# Altium schematic sheet PWR_Buck_6V_8A.SchDoc: Sayma RTM
size 420 x 297 mm; $$Internal___BlkDate: 23:43:25_12-13-18; $$Internal_NAME_PLACEHOLDER: a3sheet; $$Internal_Resolution: 00001mm; $$NotCommonProperty_@NAME: PWR_Buck_6V_8A; $$NotCommonProperty_@PRINTORDER: 4; $$NotCommonProperty_@SHEET: 1; $$NotCommonProperty_@SHEETTOTAL: 1; $$NotCommonProperty_FORWARD_PCB: 0; CmpIndex: 6; Drawing Author: G.Kasprowicz; Drawing Number: Sayma RTM; Drawing Project: 8 channel SAWG; Drawing Revision: 2.0; SymIndex: 2227; Author: G.Kasprowicz; CompanyName: WUT ISE; DrawnBy: G.Kasprowicz; Organization: WUT ISE; Address1: PW ISE; Address2: Nowowiejska 15/19 00-665 Warsaw; Address3: gkasprow@gmail.com; DocumentNumber: 13; Revision: 1.0; SheetNumber: 13; SheetTotal: 18; ModifiedBy: -; CheckedDate: -; Title2: +6V buck; DivGrp: WUT ISE; Designer: G.Kasprowicz; ModifiedDate: -; ProjectName: Sensor Box
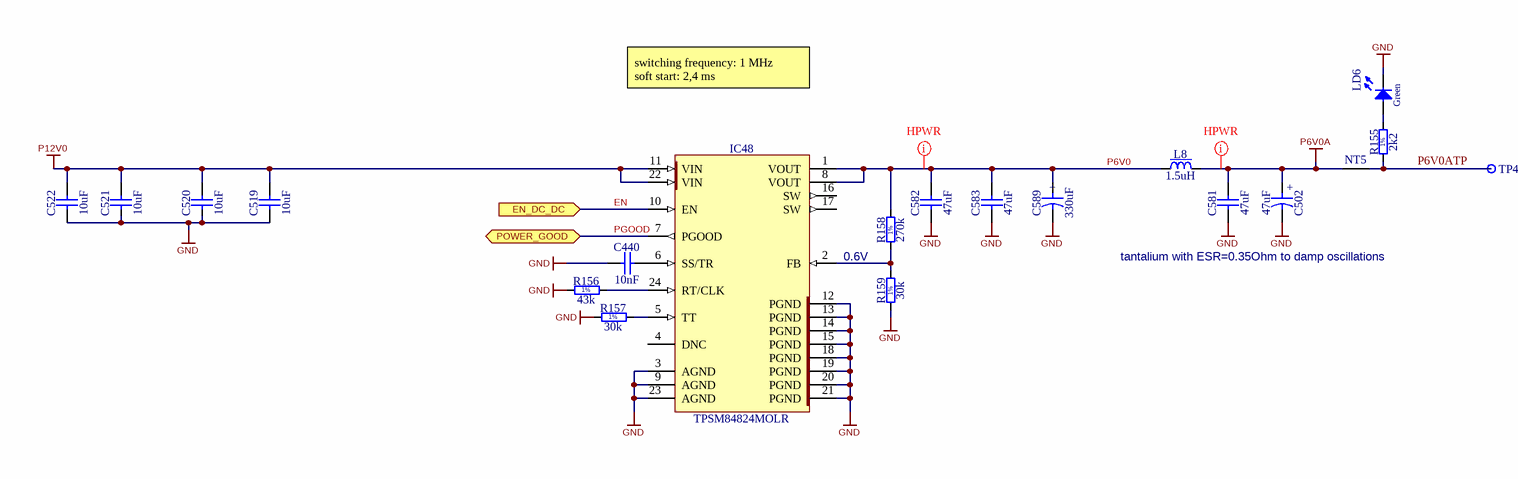
[diagram p0: PWR_Buck_6V_8A.SchDoc]

## Parts
C440  10nF  [CAPC1005X55N]
C502  47uF  [CAPMP6032X280N]
C519  10uF  [CAPC2012X95N]
C520  10uF  [CAPC2012X95N]
C521  10uF  [CAPC2012X95N]
C522  10uF  [CAPC2012X95N]
C581  47uF  [CAPC3225X270N]
C582  47uF  [CAPC3225X270N]
C583  47uF  [CAPC3225X270N]
C589  330uF  [CAPMP7343X310N]
IC48  TPSM84824MOLR  [TEXAS_QFM (MOL)]
L8  1.5uH  [IND_TDK_SPM6530]
LD6  Green  [LED_KINGBRIGHT_KPH-1608CGCK]
NT5  Net Tie  [Net Tie]  (value not drawn)  (net tie, no BOM)
R155  2k2  [RESC1005X40N]
R156  43k  [RESC1005X40N]
R157  30k  [RESC1005X40N]
R158  270k  [RESC1005X40N]
R159  30k  [RESC1005X40N]
TP48  Test Point  [TPS127]  (value not drawn)

## Ports
EN_DC_DC (in), POWER_GOOD (bidir)

## Nets
GND: C440.1 C502.2 C519.1 C520.1 C521.1 C522.1 C581.1 C582.1 C583.1 C589.2 IC48.3(AGND) IC48.9(AGND) IC48.12(PGND) IC48.13(PGND) IC48.14(PGND) IC48.15(PGND) IC48.18(PGND) IC48.19(PGND) IC48.20(PGND) IC48.21(PGND) IC48.23(AGND) LD6.1(C) R156.1 R157.1 R159.1
P6V0A: C502.1 C581.2 L8.2 NT5.1
P12V0: C519.2 C520.2 C521.2 C522.2 IC48.11(VIN) IC48.22(VIN)
EN: IC48.10(EN) ; port EN_DC_DC
P6V0: C582.2 C583.2 C589.1 IC48.1(VOUT) IC48.8(VOUT) L8.1 R158.2
P6V0ATP: NT5.2 R155.1 TP48.1
PGOOD: IC48.7(PGOOD) ; port POWER_GOOD
NetC440_2: C440.2 IC48.6(SS/TR)
NetIC48_2: IC48.2(FB) R158.1 R159.2
NetIC48_5: IC48.5(TT) R157.2
NetIC48_24: IC48.24(RT/CLK) R156.2
NetLD6_2: LD6.2(A) R155.2

Not connected (* = marked no-connect by the designer): IC48 4(DNC) 16(SW) 17(SW)

## Layout directives
net class HPWR: P6V0, P6V0A

## Notes on the sheet
- switching frequency: 1 MHz
  soft start: 2,4 ms
- 0.6V
- tantalium with ESR=0.35Ohm to damp oscillations
- Project/Equipment
- Document
- Designer
- Drawn by
- Check.by
- Copyright WUT ISE 2018.
  This documentation describes Open Hardware and is licensed under the CERN OHL v.1.1. You may redistribute and modify this documentation under the terms of the CERN OHL v.1.1. (http://ohwr.org/CERNOHL). This documentation is distributed WITHOUT ANY EXPRESS OR IMPLIED WARRANTY, INCLUDING OF MERCHANTABILITY, SATISFACTORY QUALITY AND FITNESS FOR A PARTICULAR PURPOSE. Please see the CERN OHL v.1.1 for applicable conditions.
- Contact
- File
- Last Mod.
- Print Date
- Sheet
- Size
- A3
- of
- Rev
- (in symbol CTE6032-28_47UF_16V_10%_LESR0350) +
- (in symbol CTE7343-31_330UF_6.3V_20%_LESR0015_KEMET_T520) +
- (in symbol R0402_2K2_1%_0.0625W_100PPM) 1%
- (in symbol R0402_30K_1%_0.0625W_100PPM) 1%
- (in symbol R0402_30k_1%_0.0625W_100PPM) 1%
- (in symbol R0402_43K_1%_0.0625W_100PPM) 1%
- (in symbol R0402_270K_1%_0.0625W_100PPM) 1%

## Library data of the parts
C440 = CC0402_10NF_16V_10%_X7R: Non-polarised capacitor; Manufacturer: GENERIC; Manufacturer1 Part Number: 223878715636; Part Description: SMD Multilayer Chip Ceramic Capacitor; TC: X7R; Tolerance: ±10%; Voltage: 16V; Case: 0402; Manufacturer Part Number: CC0402_10NF_16V_10%_X7R; Manufacturer1 Example: PHYCOMP; Part Number: CC0402_10NF_16V_10%_X7R; Pin Count: 2; SMD: Yes; Status: Not Recommended; Value: 10nF; Component Kind: Standard; Component Type: Standard; Mounted: Yes; Socket: No; Sense: No; Manufacturer1 ComponentHeight: 0.55mm; HelpURL: \\cern.ch\dfs\Applications\Altium\Datasheets\CC0402_X7R_PHYCOMP.pdf; Author: CERN DEM JLC; CreateDate: 03.12.2007; LatestRevisionDate: 03.12.2007
C502 = CTE6032-28_47UF_16V_10%_LESR0350: Polarised capacitor; Manufacturer: GENERIC; Manufacturer1 Part Number: TPSC476K016R0350; Part Description: Low ESR 0R350 Solid Tantalum Chip Capacitor; Tolerance: ±10%; Voltage: 16V; Case: C; Manufacturer Part Number: CTE6032-28_47UF_16V_10%_LESR0350; Manufacturer1 Example: AVX; Part Number: CTE6032-28_47UF_16V_10%_LESR0350; Pin Count: 2; SMD: Yes; Value: 47uF; Component Kind: Standard; Component Type: Standard; Status: Preferred; Mounted: Yes; Socket: No; Sense: No; Manufacturer1 ComponentHeight: 2.8mm; HelpURL: \\cern.ch\dfs\Applications\Altium\Datasheets\CTE-LESR_AVX_TPS.pdf; Author: CERN DEM JLC; CreateDate: 05.05.2008; LatestRevisionDate: 20.01.2009
C519-C522 = CC0805_10UF_25V_10%_X5R: Non-polarised capacitor; Manufacturer: GENERIC; Manufacturer1 Part Number: GRM219R61E106KA12D; Part Description: SMD Multilayer Chip Ceramic Capacitor; TC: X5R; Tolerance: ±10%; Voltage: 25V; Case: 0805; Manufacturer Part Number: CC0805_10UF_25V_10%_X5R; Manufacturer1 Example: MURATA; Part Number: CC0805_10UF_25V_10%_X5R; Pin Count: 2; SMD: Yes; Status: Preferred; Value: 10uF; Component Kind: Standard; Component Type: Standard; Mounted: Yes; Socket: No; Sense: No; Manufacturer1 ComponentHeight: 0.95mm; HelpURL: \\cern.ch\dfs\Applications\Altium\Datasheets\CC0805_X5R_MURATA_GRM.pdf; Author: CERN DEM JLC; CreateDate: 25.10.2012; LatestRevisionDate: 06.09.2016
C581-C583 = CC1210_47UF_10V_10%_X7R: Non-polarised capacitor; Manufacturer: GENERIC; Manufacturer1 Part Number: GRM32ER71A476KE15; Part Description: SMD Multilayer Chip Ceramic Capacitor; TC: X7R; Tolerance: ±10%; Voltage: 10V; Case: 1210; Manufacturer Part Number: CC1210_47UF_10V_10%_X7R; Manufacturer1 Example: MURATA; Part Number: CC1210_47UF_10V_10%_X7R; Pin Count: 2; SMD: Yes; Status: None; Value: 47uF; Component Kind: Standard; Component Type: Standard; Mounted: Yes; Socket: No; Sense: No; Manufacturer1 ComponentHeight: 2.7mm; HelpURL: \\cern.ch\dfs\Applications\Altium\Datasheets\CC1210_X7R_MURATA.pdf; Author: CERN DEM BC; CreateDate: 18.11.2015; LatestRevisionDate: 18.11.2015
C589 = CTE7343-31_330UF_6.3V_20%_LESR0015_KEMET_T520: Polarised capacitor; Manufacturer Part Number: T520D337M006ATE015; Manufacturer: KEMET; Part Description: Low ESR 0R015 Tantalum Chip Capacitor; Tolerance: ±20%; Voltage: 6.3V; Case: D; ComponentHeight: 3.1mm; Part Number: CTE7343-31_330UF_6.3V_20%_LESR0015_KEMET_T520; Pin Count: 2; SMD: Yes; Status: None; Value: 330uF; Component Kind: Standard; Component Type: Standard; Mounted: Yes; Socket: No; Sense: No; HelpURL: \\cern.ch\dfs\Applications\Altium\Datasheets\CTE-LESR_KEMET_T520.pdf; Author: CERN DEM JLC; CreateDate: 11.01.2012; LatestRevisionDate: 11.01.2012
IC48 = TPSM84824MOLR: 4.5V to 17V Input, 0.6V to 10V Output, 8A Power Module; Manufacturer: TEXAS INSTRUMENTS; Bonding: No; PressFit: No; Status Comment: Solder Paste Deposition Limitation; Author: CERN DEM JLC; Case: QFN; Component Kind: Standard; Component Type: Standard; ComponentHeight: 5.4mm; CreateDate: 27.09.2018; Device: TPSM84824MOLR; HelpURL: \\cern.ch\dfs\Applications\Altium\Datasheets\TPSM84824MOLR.pdf; LatestRevisionDate: 27.09.2018; Manufacturer Part Number: TPSM84824MOLR; Mounted: Yes; PackageDescription: TEXAS QFM (MOL) Case; Part Description: 4.5V to 17V Input, 0.6V to 10V Output, 8A Power Module; Part Number: TPSM84824MOLR; Pin Count: 24; Sense: No; SMD: Yes; Socket: No; Status: Not Recommended
L8 = IND_1.5UH_20%_TDK_SPM6530: Inductor With Core; Manufacturer Part Number: SPM6530T-1R5M100; Manufacturer: TDK; Part Description: SMD Inductor for Power Circuits (Wound Metal), SPM Series; Power: 11A; Resistance: 0.0097R; Tolerance: ±20%; ComponentHeight: 3mm; Part Number: IND_1.5UH_20%_TDK_SPM6530; Pin Count: 2; SMD: Yes; Value: 1.5uH; Component Kind: Standard; Component Type: Standard; Status: None; Mounted: Yes; Socket: No; Sense: No; HelpURL: \\cern.ch\dfs\Applications\Altium\Datasheets\IND_TDK_SPM6530.pdf; Author: CERN DEM MR; CreateDate: 08.11.2016; LatestRevisionDate: 08.11.2016
LD6 = LED_KINGBRIGHT_KPH-1608CGCK: LED Green 1C 2A; Part Description: SMD Green LED, Case 1.6mmX0.8mm(0603), 0.65mm Thickness; Bonding: No; PressFit: No; Author: CERN DEM JLC; Color: Green; Component Kind: Standard; Component Type: Standard; ComponentHeight: 0.65mm; CreateDate: 03.07.2017; HelpURL: \\cern.ch\dfs\Applications\Altium\Datasheets\LED_KINGBRIGHT_KPH-1608CGCK.pdf; LatestRevisionDate: 03.07.2017; Manufacturer Part Number: KPH-1608CGCK; Manufacturer: KINGBRIGHT; Mounted: Yes; PackageDescription: SMT Green LED, Case 0603, Body L 1.6 x W 0.8mm H 0.65mm; Part Number: LED_KINGBRIGHT_KPH-1608CGCK; Pin Count: 2; Sense: No; SMD: Yes; Socket: No
NT5 = Net Tie: Part Description: Net Tie (2 Nets); Mounted: No; Part Number: Net Tie; Component Type: Net Tie; Pin Count: 2; Family: Net Tie; Socket: No; SMD: No; Sense: No; Status: None; ComponentHeight: 0mm; HelpURL: Undefined; Author: CERN DEM JLC; CreateDate: 22.03.2011; LatestRevisionDate: 22.03.2011; PackageDescription: 2 Plated Through Hole For Coaxial Cable Link: Hole Dia.=1.4mm Pad Dia.=2.5mm
R155 = R0402_2K2_1%_0.0625W_100PPM: Resistor - 1%; Manufacturer: GENERIC; Manufacturer1 Part Number: 232270672202L; Part Description: General Purpose Thick Film Chip Resistor; TC: ±100ppm/°C; PressFit: No; Case: 0402; Manufacturer Part Number: R0402_2K2_1%_0.0625W_100PPM; Manufacturer1 ComponentHeight: 0.4mm; Manufacturer1 Example: YAGEO PHYCOMP; Part Number: R0402_2K2_1%_0.0625W_100PPM; Pin Count: 2; Power: 0.0625W; Sense: No; SMD: Yes; Status: Not Recommended; Tolerance: ±1%; Value: 2k2; Component Kind: Standard; Component Type: Standard; Mounted: Yes; Socket: No; HelpURL: \\cern.ch\dfs\Applications\Altium\Datasheets\R0402_Phycomp_RC0402.pdf; Author: CERN DEM JLC; CreateDate: 03.12.2007; LatestRevisionDate: 17.10.2012
R156 = R0402_43K_1%_0.0625W_100PPM: Resistor - 1%; Manufacturer: GENERIC; Manufacturer1 Part Number: 232270674303L; Part Description: General Purpose Thick Film Chip Resistor; TC: ±100ppm/°C; PressFit: No; Case: 0402; Manufacturer Part Number: R0402_43K_1%_0.0625W_100PPM; Manufacturer1 ComponentHeight: 0.4mm; Manufacturer1 Example: YAGEO PHYCOMP; Part Number: R0402_43K_1%_0.0625W_100PPM; Pin Count: 2; Power: 0.0625W; Sense: No; SMD: Yes; Status: Not Recommended; Tolerance: ±1%; Value: 43k; Component Kind: Standard; Component Type: Standard; Mounted: Yes; Socket: No; HelpURL: \\cern.ch\dfs\Applications\Altium\Datasheets\R0402_Phycomp_RC0402.pdf; Author: CERN DEM JLC; CreateDate: 2007-12-03; LatestRevisionDate: 2012-10-17
R157 = R0402_30k_1%_0.0625W_100PPM: Resistor - 1%; Manufacturer: GENERIC; Manufacturer1 Part Number: 232270673003L; Part Description: General Purpose Thick Film Chip Resistor; TC: ±100ppm/°C; PressFit: No; Case: 0402; Manufacturer Part Number: R0402_30K_1%_0.0625W_100PPM; Manufacturer1 ComponentHeight: 0.4mm; Manufacturer1 Example: YAGEO PHYCOMP; Part Number: R0402_30K_1%_0.0625W_100PPM; Pin Count: 2; Power: 0.0625W; Sense: No; SMD: Yes; Status: Not Recommended; Tolerance: ±1%; Value: 30k; Component Kind: Standard; Component Type: Standard; Mounted: Yes; Socket: No; HelpURL: \\cern.ch\dfs\Applications\Altium\Datasheets\R0402_Phycomp_RC0402.pdf; Author: CERN DEM JLC; CreateDate: 03.12.2007; LatestRevisionDate: 17.10.2012
R158 = R0402_270K_1%_0.0625W_100PPM: Resistor - 1%; Manufacturer: GENERIC; Manufacturer1 Part Number: 232270672704L; Part Description: General Purpose Thick Film Chip Resistor; TC: ±100ppm/°C; PressFit: No; Case: 0402; Manufacturer Part Number: R0402_270K_1%_0.0625W_100PPM; Manufacturer1 ComponentHeight: 0.4mm; Manufacturer1 Example: YAGEO PHYCOMP; Part Number: R0402_270K_1%_0.0625W_100PPM; Pin Count: 2; Power: 0.0625W; Sense: No; SMD: Yes; Status: Not Recommended; Tolerance: ±1%; Value: 270k; Component Kind: Standard; Component Type: Standard; Mounted: Yes; Socket: No; HelpURL: \\cern.ch\dfs\Applications\Altium\Datasheets\R0402_Phycomp_RC0402.pdf; Author: CERN DEM JLC; CreateDate: 03.12.2007; LatestRevisionDate: 17.10.2012
R159 = R0402_30K_1%_0.0625W_100PPM: Resistor - 1%; Manufacturer: GENERIC; Manufacturer1 Part Number: 232270673003L; Part Description: General Purpose Thick Film Chip Resistor; TC: ±100ppm/°C; PressFit: No; Case: 0402; Manufacturer Part Number: R0402_30K_1%_0.0625W_100PPM; Manufacturer1 ComponentHeight: 0.4mm; Manufacturer1 Example: YAGEO PHYCOMP; Part Number: R0402_30K_1%_0.0625W_100PPM; Pin Count: 2; Power: 0.0625W; Sense: No; SMD: Yes; Status: Not Recommended; Tolerance: ±1%; Value: 30k; Component Kind: Standard; Component Type: Standard; Mounted: Yes; Socket: No; HelpURL: \\cern.ch\dfs\Applications\Altium\Datasheets\R0402_Phycomp_RC0402.pdf; Author: CERN DEM JLC; CreateDate: 03.12.2007; LatestRevisionDate: 17.10.2012
TP48 = SMD_PAD_1.27X1.27MM: Part Description: 1.27mm x 1.27mm PCB Copper Area (SMD Test Point); Mounted: No; ComponentHeight: 0mm; Family: Test Point; Part Number: SMD_PAD_1.27X1.27MM; Pin Count: 1; Sense: No; SMD: Yes; Socket: No; Status: None; Component Kind: Standard (No BOM); Component Type: Standard (No BOM); HelpURL: Undefined; Author: CERN DEM JLC; CreateDate: 12.01.2008; LatestRevisionDate: 12.01.2008; PackageDescription: 1.27mm x 1.27mm PCB Copper Area (SMD Test Point)